# Altium schematic sheet HzMF_Odrive.SchDoc
size A4; DrawnBy: Chris_F; SheetNumber: 1; SheetTotal: 1
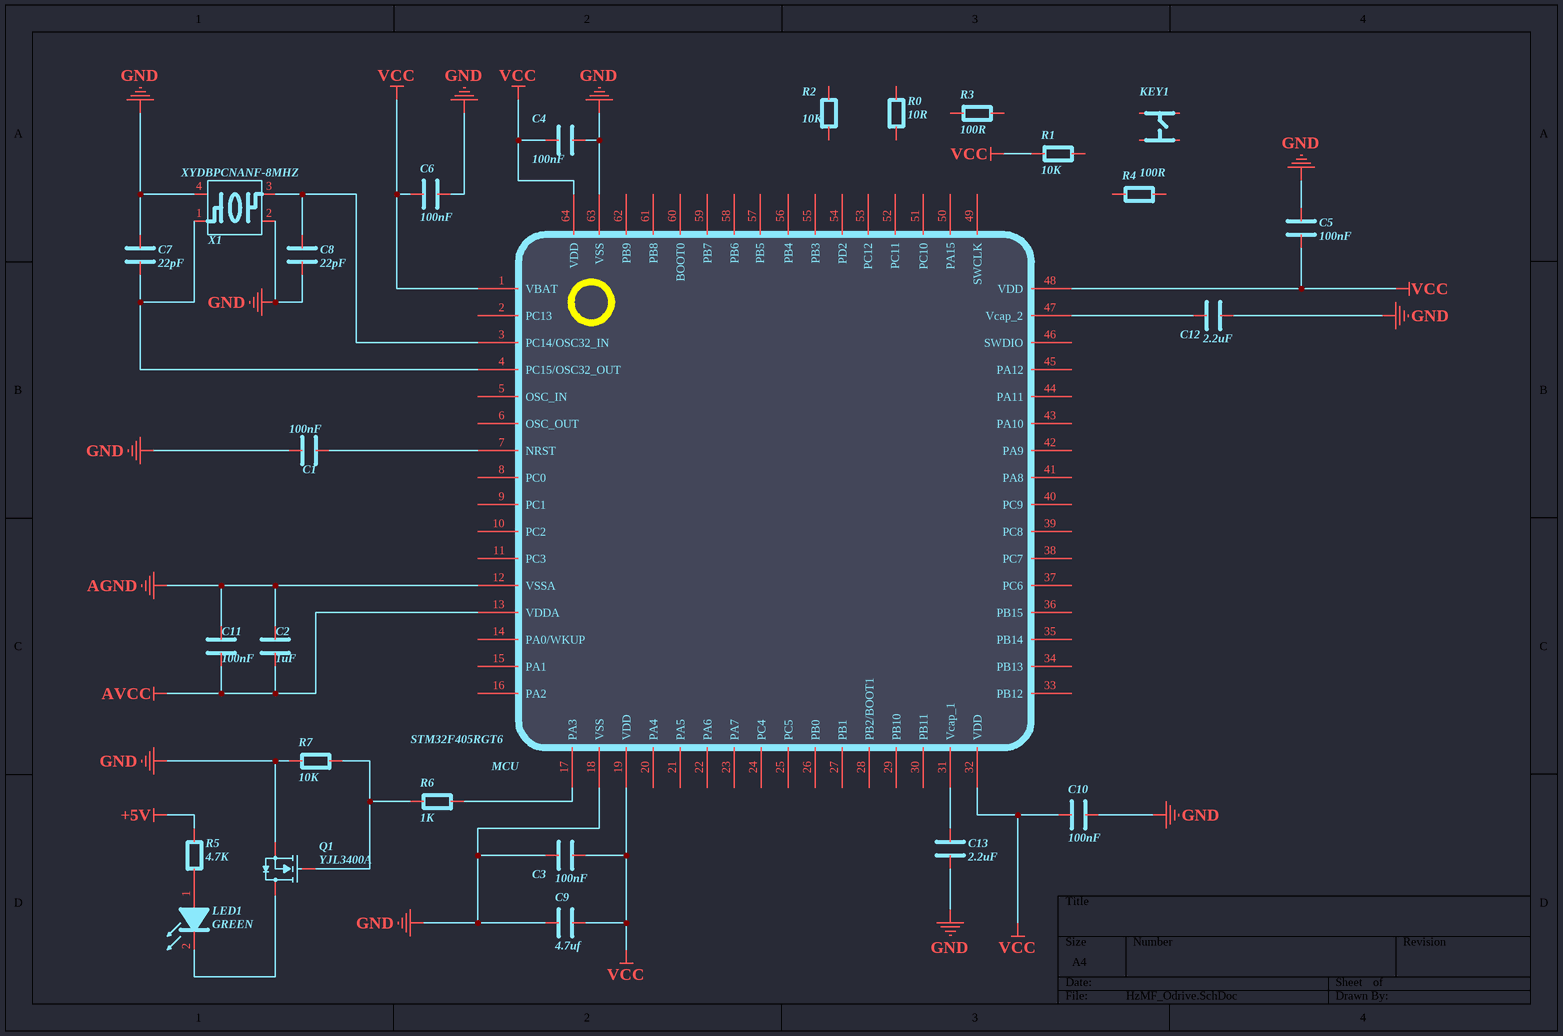
[diagram p0: HzMF_Odrive.SchDoc]

## Parts
C1  100nF  [CAP_0603]
C2  1uF  [CAP_0603]
C3  100nF  [CAP_0603]
C4  100nF  [CAP_0603]
C5  100nF  [CAP_0603]
C6  100nF  [CAP_0603]
C7  22pF  [CAP_0603]
C8  22pF  [CAP_0603]
C9  4.7uf  [CAP_0603]
C10  100nF  [CAP_0603]
C11  100nF  [CAP_0603]
C12  2.2uF  [CAP_0603]
C13  2.2uF  [CAP_0603]
KEY1  K1  [KEY-SMD_4P-L6.0-W6.0-P4.50-LS10.0]  (value not drawn)
LED1  GREEN  [LED_green]
MCU  STM32F405RGT6  [LQFP_64]
Q1  YJL3400A  [SOT23_3]
R0  10R  [RES_0603]
R1  10K  [RES_0603]
R2  10K  [RES_0603]
R3  100R  [RES_0603]
R4  100R  [RES_0603]
R5  4.7K  [RES_0603]
R6  1K  [RES_0603]
R7  10K  [RES_0603]
X1  XYDBPCNANF-8MHZ  [CARSTAL_4P_2520]

## Nets
+5V: R5.1
AGND: C2.1 C11.1 MCU.12(VSSA)
AVCC: C2.2 C11.2 MCU.13(VDDA)
GND: C1.2 C3.1 C4.2 C5.1 C6.1 C7.1 C8.2 C9.1 C10.1 C12.2 C13.2 MCU.18(VSS) MCU.63(VSS) Q1.2(S) R7.1 X1.2(GND) X1.4(GND)
VCC: C3.2 C4.1 C5.2 C6.2 C9.2 C10.2 MCU.1(VBAT) MCU.19(VDD) MCU.32(VDD) MCU.48(VDD) MCU.64(VDD) R1.2
NetC1_1: C1.1 MCU.7(NRST)
NetC7_2: C7.2 MCU.4(PC15/OSC32_OUT) X1.1
NetC8_1: C8.1 MCU.3(PC14/OSC32_IN) X1.3
NetC12_1: C12.1 MCU.47(Vcap_2)
NetC13_1: C13.1 MCU.31(Vcap_1)
NetLED1_1: LED1.1(+) R5.2
NetLED1_2: LED1.2(-) Q1.3(D)
NetMCU_17: MCU.17(PA3) R6.2
NetQ1_1: Q1.1(G) R6.1 R7.2

Not connected (* = marked no-connect by the designer): KEY1 1 2 3 4; MCU 2(PC13) 5(OSC_IN) 6(OSC_OUT) 8(PC0) 9(PC1) 10(PC2) 11(PC3) 14(PA0/WKUP) 15(PA1) 16(PA2) 20(PA4) 21(PA5) 22(PA6) 23(PA7) 24(PC4) 25(PC5) 26(PB0) 27(PB1) 28(PB2/BOOT1) 29(PB10) 30(PB11) 33(PB12) 34(PB13) 35(PB14) 36(PB15) 37(PC6) 38(PC7) 39(PC8) 40(PC9) 41(PA8) 42(PA9) 43(PA10) 44(PA11) 45(PA12) 46(SWDIO) 49(SWCLK) 50(PA15) 51(PC10) 52(PC11) 53(PC12) 54(PD2) 55(PB3) 56(PB4) 57(PB5) 58(PB6) 59(PB7) 60(BOOT0) 61(PB8) 62(PB9); R0 1 2; R1 1; R2 1 2; R3 1 2; R4 1 2

## Library data of the parts
C1 = C
C2-C13 = C: 电容
KEY1 = Button_4P: Button; type: TACT 4P
LED1 = LED: LED灯
MCU = STM32F405RGT6: STM32F4
Q1 = MOSFET_N: N_MOS
R0 R2-R7 = R: 电阻
R1 = R
X1 = Crystal_4P: 四脚无源晶振; Manufacturer: TAITIEN(泰艺电子); Symbol: XYDBPCNANF-12MHZ; Add into BOM: yes; Name: -; Device: XYDBPCNANF-12MHZ; Convert to PCB: yes; LCSC Part Name: 12MHz 12pF ±10ppm -20~+70℃; Supplier Part: C521567; Manufacturer Part: XYDBPCNANF-12MHZ; Supplier Footprint: SMD2520-4P; JLCPCB Part Class: 扩展库; Datasheet: https://atta.szlcsc.com/upload/public/pdf/source/20200427/C521567_8D8DDB0F2E066B5BAD7A5878EBE465E2.pdf; Supplier: LCSC; Crystal Type: -; Value: -; Frequency Tolerance: -; Frequency Stability: -; Load Capacitance: -; Operating Temperature: -